# EAGLE schematic untitled (EAGLE 9.5.2)
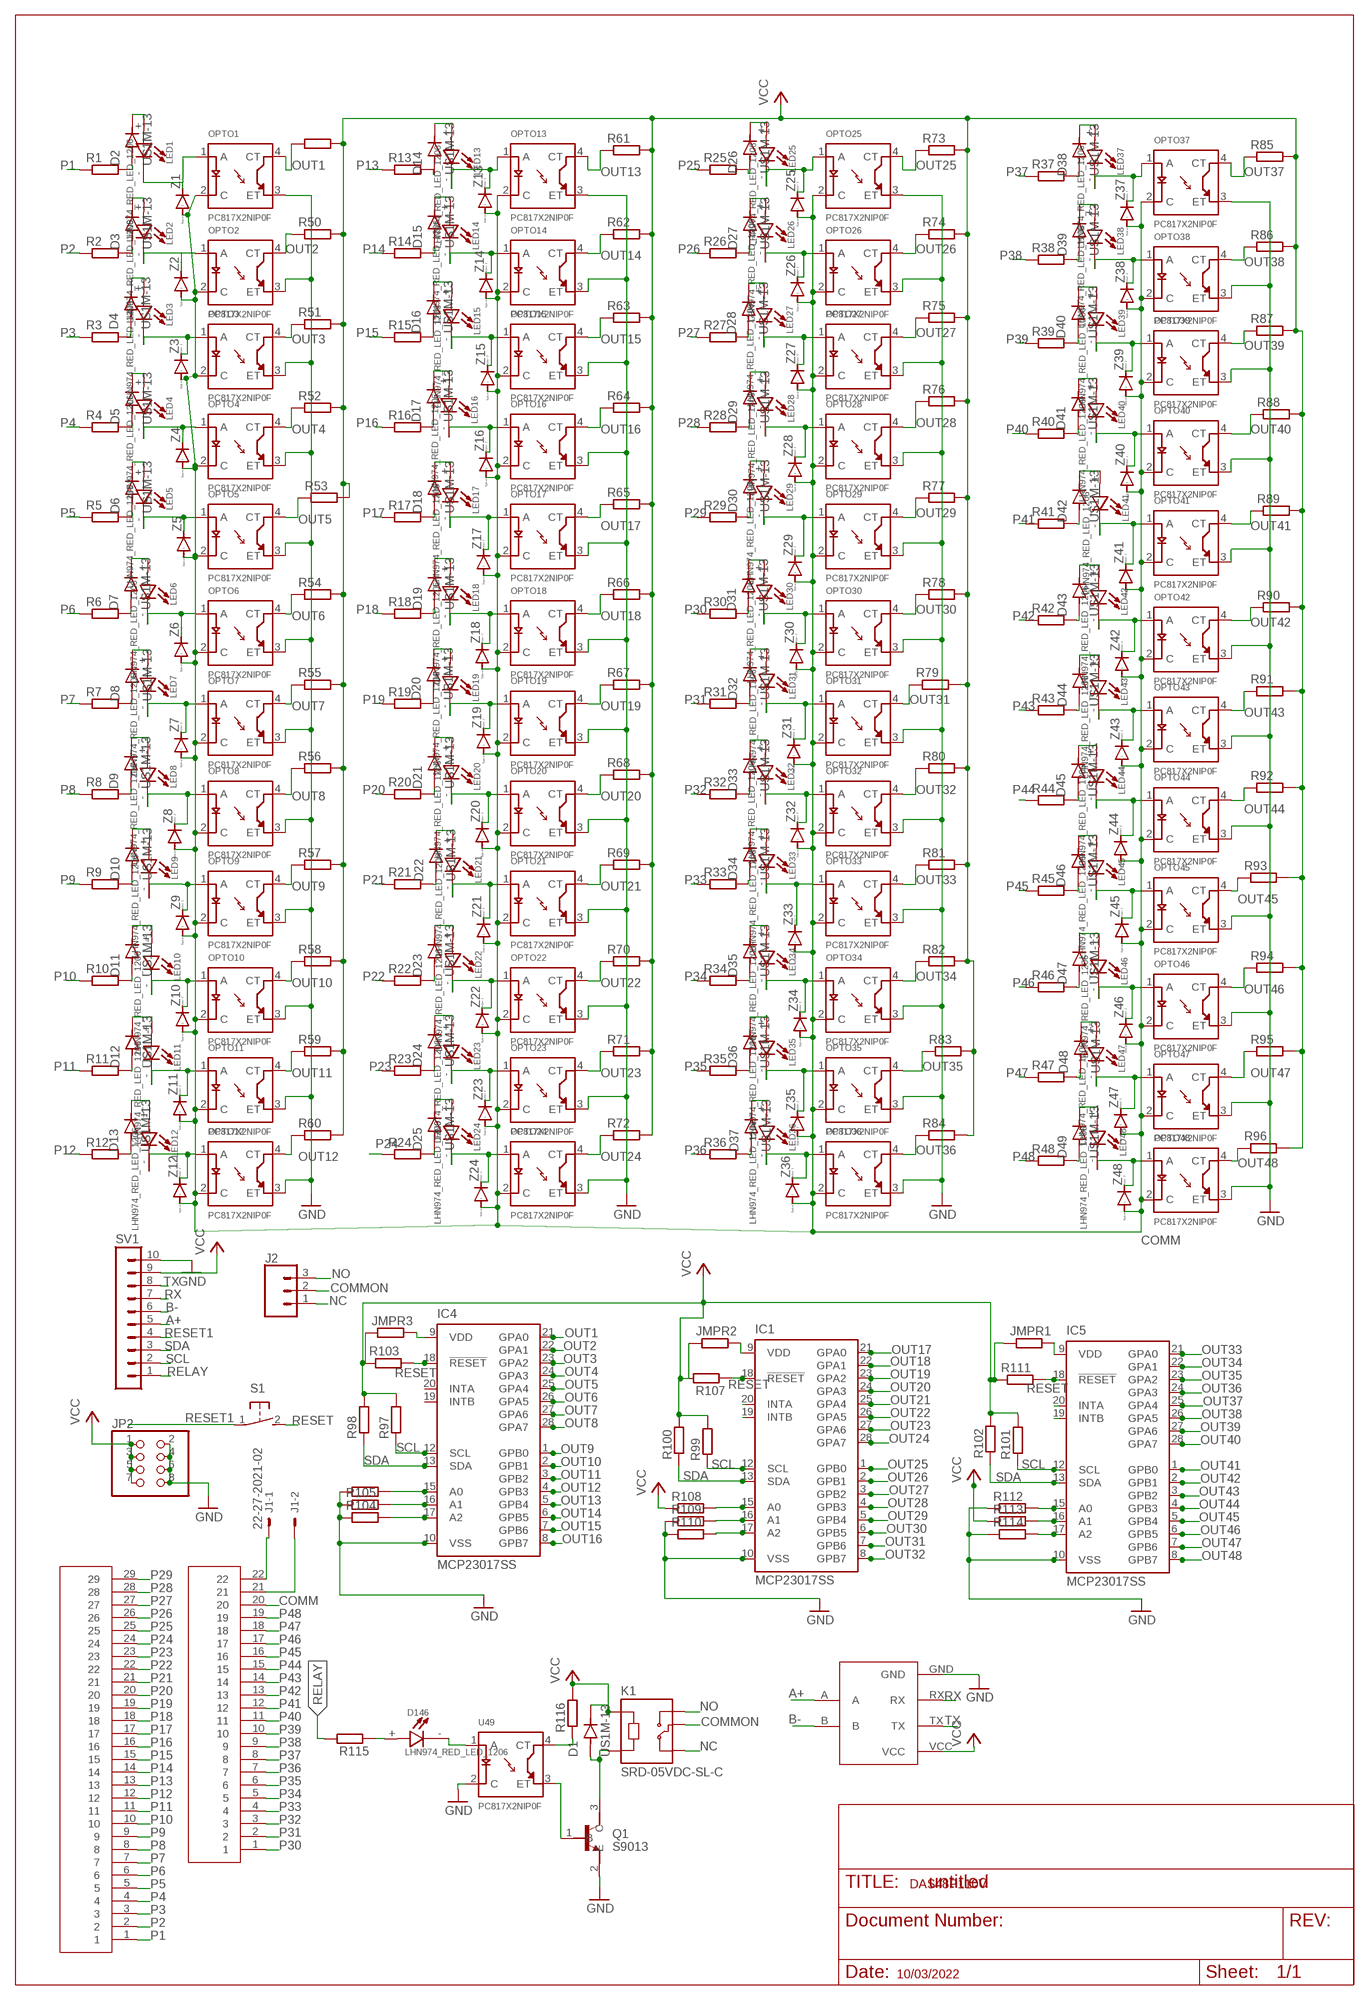
[diagram p0: schematic, sheet 1]

## Parts
D1  US1M-13  [DIOM5226X240N]
D2  US1M-13  [DIOM5226X240N]
D3  US1M-13  [DIOM5226X240N]
D4  US1M-13  [DIOM5226X240N]
D5  US1M-13  [DIOM5226X240N]
D6  US1M-13  [DIOM5226X240N]
D7  US1M-13  [DIOM5226X240N]
D8  US1M-13  [DIOM5226X240N]
D9  US1M-13  [DIOM5226X240N]
D10  US1M-13  [DIOM5226X240N]
D11  US1M-13  [DIOM5226X240N]
D12  US1M-13  [DIOM5226X240N]
D13  US1M-13  [DIOM5226X240N]
D14  US1M-13  [DIOM5226X240N]
D15  US1M-13  [DIOM5226X240N]
D16  US1M-13  [DIOM5226X240N]
D17  US1M-13  [DIOM5226X240N]
D18  US1M-13  [DIOM5226X240N]
D19  US1M-13  [DIOM5226X240N]
D20  US1M-13  [DIOM5226X240N]
D21  US1M-13  [DIOM5226X240N]
D22  US1M-13  [DIOM5226X240N]
D23  US1M-13  [DIOM5226X240N]
D24  US1M-13  [DIOM5226X240N]
D25  US1M-13  [DIOM5226X240N]
D26  US1M-13  [DIOM5226X240N]
D27  US1M-13  [DIOM5226X240N]
D28  US1M-13  [DIOM5226X240N]
D29  US1M-13  [DIOM5226X240N]
D30  US1M-13  [DIOM5226X240N]
D31  US1M-13  [DIOM5226X240N]
D32  US1M-13  [DIOM5226X240N]
D33  US1M-13  [DIOM5226X240N]
D34  US1M-13  [DIOM5226X240N]
D35  US1M-13  [DIOM5226X240N]
D36  US1M-13  [DIOM5226X240N]
D37  US1M-13  [DIOM5226X240N]
D38  US1M-13  [DIOM5226X240N]
D39  US1M-13  [DIOM5226X240N]
D40  US1M-13  [DIOM5226X240N]
D41  US1M-13  [DIOM5226X240N]
D42  US1M-13  [DIOM5226X240N]
D43  US1M-13  [DIOM5226X240N]
D44  US1M-13  [DIOM5226X240N]
D45  US1M-13  [DIOM5226X240N]
D46  US1M-13  [DIOM5226X240N]
D47  US1M-13  [DIOM5226X240N]
D48  US1M-13  [DIOM5226X240N]
D49  US1M-13  [DIOM5226X240N]
D146  LHN974_RED_LED_1206  [LEDC3216X120N]
HEADER-22P1  HEADER-22P  [HEADER-29P]
HEADER-29P1  HEADER-29P  [HEADER-29P]
IC1  MCP23017SS  [SSOP28DB]
IC4  MCP23017SS  [SSOP28DB]
IC5  MCP23017SS  [SSOP28DB]
J1  22-27-2021-02  [6410-02]
J2  CONN_03LONGPADS  [1X03_LONGPADS]
JMPR1  R-EU_R0402  [R0402]
JMPR2  R-EU_R0402  [R0402]
JMPR3  R-EU_R0402  [R0402]
JP2  PINHD-2X4  [2X04]
K1  SRD-05VDC-SL-C  [RELAY_SRD-05VDC-SL-C]
LED1  LHN974_RED_LED_1206  [LEDC3216X120N]
LED2  LHN974_RED_LED_1206  [LEDC3216X120N]
LED3  LHN974_RED_LED_1206  [LEDC3216X120N]
LED4  LHN974_RED_LED_1206  [LEDC3216X120N]
LED5  LHN974_RED_LED_1206  [LEDC3216X120N]
LED6  LHN974_RED_LED_1206  [LEDC3216X120N]
LED7  LHN974_RED_LED_1206  [LEDC3216X120N]
LED8  LHN974_RED_LED_1206  [LEDC3216X120N]
LED9  LHN974_RED_LED_1206  [LEDC3216X120N]
LED10  LHN974_RED_LED_1206  [LEDC3216X120N]
LED11  LHN974_RED_LED_1206  [LEDC3216X120N]
LED12  LHN974_RED_LED_1206  [LEDC3216X120N]
LED13  LHN974_RED_LED_1206  [LEDC3216X120N]
LED14  LHN974_RED_LED_1206  [LEDC3216X120N]
LED15  LHN974_RED_LED_1206  [LEDC3216X120N]
LED16  LHN974_RED_LED_1206  [LEDC3216X120N]
LED17  LHN974_RED_LED_1206  [LEDC3216X120N]
LED18  LHN974_RED_LED_1206  [LEDC3216X120N]
LED19  LHN974_RED_LED_1206  [LEDC3216X120N]
LED20  LHN974_RED_LED_1206  [LEDC3216X120N]
LED21  LHN974_RED_LED_1206  [LEDC3216X120N]
LED22  LHN974_RED_LED_1206  [LEDC3216X120N]
LED23  LHN974_RED_LED_1206  [LEDC3216X120N]
LED24  LHN974_RED_LED_1206  [LEDC3216X120N]
LED25  LHN974_RED_LED_1206  [LEDC3216X120N]
LED26  LHN974_RED_LED_1206  [LEDC3216X120N]
LED27  LHN974_RED_LED_1206  [LEDC3216X120N]
LED28  LHN974_RED_LED_1206  [LEDC3216X120N]
LED29  LHN974_RED_LED_1206  [LEDC3216X120N]
LED30  LHN974_RED_LED_1206  [LEDC3216X120N]
LED31  LHN974_RED_LED_1206  [LEDC3216X120N]
LED32  LHN974_RED_LED_1206  [LEDC3216X120N]
LED33  LHN974_RED_LED_1206  [LEDC3216X120N]
LED34  LHN974_RED_LED_1206  [LEDC3216X120N]
LED35  LHN974_RED_LED_1206  [LEDC3216X120N]
LED36  LHN974_RED_LED_1206  [LEDC3216X120N]
LED37  LHN974_RED_LED_1206  [LEDC3216X120N]
LED38  LHN974_RED_LED_1206  [LEDC3216X120N]
LED39  LHN974_RED_LED_1206  [LEDC3216X120N]
LED40  LHN974_RED_LED_1206  [LEDC3216X120N]
LED41  LHN974_RED_LED_1206  [LEDC3216X120N]
LED42  LHN974_RED_LED_1206  [LEDC3216X120N]
LED43  LHN974_RED_LED_1206  [LEDC3216X120N]
LED44  LHN974_RED_LED_1206  [LEDC3216X120N]
LED45  LHN974_RED_LED_1206  [LEDC3216X120N]
LED46  LHN974_RED_LED_1206  [LEDC3216X120N]
LED47  LHN974_RED_LED_1206  [LEDC3216X120N]
LED48  LHN974_RED_LED_1206  [LEDC3216X120N]
OPTO1  PC817X2NIP0F  [SOT254P975X400-4N]
OPTO2  PC817X2NIP0F  [SOT254P975X400-4N]
OPTO3  PC817X2NIP0F  [SOT254P975X400-4N]
OPTO4  PC817X2NIP0F  [SOT254P975X400-4N]
OPTO5  PC817X2NIP0F  [SOT254P975X400-4N]
OPTO6  PC817X2NIP0F  [SOT254P975X400-4N]
OPTO7  PC817X2NIP0F  [SOT254P975X400-4N]
OPTO8  PC817X2NIP0F  [SOT254P975X400-4N]
OPTO9  PC817X2NIP0F  [SOT254P975X400-4N]
OPTO10  PC817X2NIP0F  [SOT254P975X400-4N]
OPTO11  PC817X2NIP0F  [SOT254P975X400-4N]
OPTO12  PC817X2NIP0F  [SOT254P975X400-4N]
OPTO13  PC817X2NIP0F  [SOT254P975X400-4N]
OPTO14  PC817X2NIP0F  [SOT254P975X400-4N]
OPTO15  PC817X2NIP0F  [SOT254P975X400-4N]
OPTO16  PC817X2NIP0F  [SOT254P975X400-4N]
OPTO17  PC817X2NIP0F  [SOT254P975X400-4N]
OPTO18  PC817X2NIP0F  [SOT254P975X400-4N]
OPTO19  PC817X2NIP0F  [SOT254P975X400-4N]
OPTO20  PC817X2NIP0F  [SOT254P975X400-4N]
OPTO21  PC817X2NIP0F  [SOT254P975X400-4N]
OPTO22  PC817X2NIP0F  [SOT254P975X400-4N]
OPTO23  PC817X2NIP0F  [SOT254P975X400-4N]
OPTO24  PC817X2NIP0F  [SOT254P975X400-4N]
OPTO25  PC817X2NIP0F  [SOT254P975X400-4N]
OPTO26  PC817X2NIP0F  [SOT254P975X400-4N]
OPTO27  PC817X2NIP0F  [SOT254P975X400-4N]
OPTO28  PC817X2NIP0F  [SOT254P975X400-4N]
OPTO29  PC817X2NIP0F  [SOT254P975X400-4N]
OPTO30  PC817X2NIP0F  [SOT254P975X400-4N]
OPTO31  PC817X2NIP0F  [SOT254P975X400-4N]
OPTO32  PC817X2NIP0F  [SOT254P975X400-4N]
OPTO33  PC817X2NIP0F  [SOT254P975X400-4N]
OPTO34  PC817X2NIP0F  [SOT254P975X400-4N]
OPTO35  PC817X2NIP0F  [SOT254P975X400-4N]
OPTO36  PC817X2NIP0F  [SOT254P975X400-4N]
OPTO37  PC817X2NIP0F  [SOT254P975X400-4N]
OPTO38  PC817X2NIP0F  [SOT254P975X400-4N]
OPTO39  PC817X2NIP0F  [SOT254P975X400-4N]
OPTO40  PC817X2NIP0F  [SOT254P975X400-4N]
OPTO41  PC817X2NIP0F  [SOT254P975X400-4N]
OPTO42  PC817X2NIP0F  [SOT254P975X400-4N]
OPTO43  PC817X2NIP0F  [SOT254P975X400-4N]
OPTO44  PC817X2NIP0F  [SOT254P975X400-4N]
OPTO45  PC817X2NIP0F  [SOT254P975X400-4N]
OPTO46  PC817X2NIP0F  [SOT254P975X400-4N]
OPTO47  PC817X2NIP0F  [SOT254P975X400-4N]
OPTO48  PC817X2NIP0F  [SOT254P975X400-4N]
Q1  S9013  [SOT95P240X120-3N]
R1  R-EU_0617/17  [0617/17]
R2  R-EU_0617/17  [0617/17]
R3  R-EU_0617/17  [0617/17]
R4  R-EU_0617/17  [0617/17]
R5  R-EU_0617/17  [0617/17]
R6  R-EU_0617/17  [0617/17]
R7  R-EU_0617/17  [0617/17]
R8  R-EU_0617/17  [0617/17]
R9  R-EU_0617/17  [0617/17]
R10  R-EU_0617/17  [0617/17]
R11  R-EU_0617/17  [0617/17]
R12  R-EU_0617/17  [0617/17]
R13  R-EU_0617/17  [0617/17]
R14  R-EU_0617/17  [0617/17]
R15  R-EU_0617/17  [0617/17]
R16  R-EU_0617/17  [0617/17]
R17  R-EU_0617/17  [0617/17]
R18  R-EU_0617/17  [0617/17]
R19  R-EU_0617/17  [0617/17]
R20  R-EU_0617/17  [0617/17]
R21  R-EU_0617/17  [0617/17]
R22  R-EU_0617/17  [0617/17]
R23  R-EU_0617/17  [0617/17]
R24  R-EU_0617/17  [0617/17]
R25  R-EU_0617/17  [0617/17]
R26  R-EU_0617/17  [0617/17]
R27  R-EU_0617/17  [0617/17]
R28  R-EU_0617/17  [0617/17]
R29  R-EU_0617/17  [0617/17]
R30  R-EU_0617/17  [0617/17]
R31  R-EU_0617/17  [0617/17]
R32  R-EU_0617/17  [0617/17]
R33  R-EU_0617/17  [0617/17]
R34  R-EU_0617/17  [0617/17]
R35  R-EU_0617/17  [0617/17]
R36  R-EU_0617/17  [0617/17]
R37  R-EU_0617/17  [0617/17]
R38  R-EU_0617/17  [0617/17]
R39  R-EU_0617/17  [0617/17]
R40  R-EU_0617/17  [0617/17]
R41  R-EU_0617/17  [0617/17]
R42  R-EU_0617/17  [0617/17]
R43  R-EU_0617/17  [0617/17]
R44  R-EU_0617/17  [0617/17]
R45  R-EU_0617/17  [0617/17]
R46  R-EU_0617/17  [0617/17]
R47  R-EU_0617/17  [0617/17]
R48  R-EU_0617/17  [0617/17]
R49  R-EU_R0805  [R0805]
R50  R-EU_R0805  [R0805]
R51  R-EU_R0805  [R0805]
R52  R-EU_R0805  [R0805]
R53  R-EU_R0805  [R0805]
R54  R-EU_R0805  [R0805]
R55  R-EU_R0805  [R0805]
R56  R-EU_R0805  [R0805]
R57  R-EU_R0805  [R0805]
R58  R-EU_R0805  [R0805]
R59  R-EU_R0805  [R0805]
R60  R-EU_R0805  [R0805]
R61  R-EU_R0805  [R0805]
R62  R-EU_R0805  [R0805]
R63  R-EU_R0805  [R0805]
R64  R-EU_R0805  [R0805]
R65  R-EU_R0805  [R0805]
R66  R-EU_R0805  [R0805]
R67  R-EU_R0805  [R0805]
R68  R-EU_R0805  [R0805]
R69  R-EU_R0805  [R0805]
R70  R-EU_R0805  [R0805]
R71  R-EU_R0805  [R0805]
R72  R-EU_R0805  [R0805]
R73  R-EU_R0805  [R0805]
R74  R-EU_R0805  [R0805]
R75  R-EU_R0805  [R0805]
R76  R-EU_R0805  [R0805]
R77  R-EU_R0805  [R0805]
R78  R-EU_R0805  [R0805]
R79  R-EU_R0805  [R0805]
R80  R-EU_R0805  [R0805]
R81  R-EU_R0805  [R0805]
R82  R-EU_R0805  [R0805]
R83  R-EU_R0805  [R0805]
R84  R-EU_R0805  [R0805]
R85  R-EU_R0805  [R0805]
R86  R-EU_R0805  [R0805]
R87  R-EU_R0805  [R0805]
R88  R-EU_R0805  [R0805]
R89  R-EU_R0805  [R0805]
R90  R-EU_R0805  [R0805]
R91  R-EU_R0805  [R0805]
R92  R-EU_R0805  [R0805]
R93  R-EU_R0805  [R0805]
R94  R-EU_R0805  [R0805]
R95  R-EU_R0805  [R0805]
R96  R-EU_R0805  [R0805]
R97  R-EU_R0805  [R0805]
R98  R-EU_R0805  [R0805]
R99  R-EU_R0805  [R0805]
R100  R-EU_R0805  [R0805]
R101  R-EU_R0805  [R0805]
R102  R-EU_R0805  [R0805]
R103  R-EU_R0805  [R0805]
R104  R-EU_R0805  [R0805]
R105  R-EU_R0805  [R0805]
R106  R-EU_R0805  [R0805]
R107  R-EU_R0805  [R0805]
R108  R-EU_R0805  [R0805]
R109  R-EU_R0805  [R0805]
R110  R-EU_R0805  [R0805]
R111  R-EU_R0805  [R0805]
R112  R-EU_R0805  [R0805]
R113  R-EU_R0805  [R0805]
R114  R-EU_R0805  [R0805]
R115  R-EU_R0805  [R0805]
R116  R-EU_R0805  [R0805]
S1  31-XX  [B3F-31XX]
SV1  MA10-1  [MA10-1]
TTL-RS1  TTL-RS485  [TTL-RS485]
U49  PC817X2NIP0F  [SOT254P975X400-4N]
Z1  DIODE-SOD123  [SOD123]
Z2  DIODE-SOD123  [SOD123]
Z3  DIODE-SOD123  [SOD123]
Z4  DIODE-SOD123  [SOD123]
Z5  DIODE-SOD123  [SOD123]
Z6  DIODE-SOD123  [SOD123]
Z7  DIODE-SOD123  [SOD123]
Z8  DIODE-SOD123  [SOD123]
Z9  DIODE-SOD123  [SOD123]
Z10  DIODE-SOD123  [SOD123]
Z11  DIODE-SOD123  [SOD123]
Z12  DIODE-SOD123  [SOD123]
Z13  DIODE-SOD123  [SOD123]
Z14  DIODE-SOD123  [SOD123]
Z15  DIODE-SOD123  [SOD123]
Z16  DIODE-SOD123  [SOD123]
Z17  DIODE-SOD123  [SOD123]
Z18  DIODE-SOD123  [SOD123]
Z19  DIODE-SOD123  [SOD123]
Z20  DIODE-SOD123  [SOD123]
Z21  DIODE-SOD123  [SOD123]
Z22  DIODE-SOD123  [SOD123]
Z23  DIODE-SOD123  [SOD123]
Z24  DIODE-SOD123  [SOD123]
Z25  DIODE-SOD123  [SOD123]
Z26  DIODE-SOD123  [SOD123]
Z27  DIODE-SOD123  [SOD123]
Z28  DIODE-SOD123  [SOD123]
Z29  DIODE-SOD123  [SOD123]
Z30  DIODE-SOD123  [SOD123]
Z31  DIODE-SOD123  [SOD123]
Z32  DIODE-SOD123  [SOD123]
Z33  DIODE-SOD123  [SOD123]
Z34  DIODE-SOD123  [SOD123]
Z35  DIODE-SOD123  [SOD123]
Z36  DIODE-SOD123  [SOD123]
Z37  DIODE-SOD123  [SOD123]
Z38  DIODE-SOD123  [SOD123]
Z39  DIODE-SOD123  [SOD123]
Z40  DIODE-SOD123  [SOD123]
Z41  DIODE-SOD123  [SOD123]
Z42  DIODE-SOD123  [SOD123]
Z43  DIODE-SOD123  [SOD123]
Z44  DIODE-SOD123  [SOD123]
Z45  DIODE-SOD123  [SOD123]
Z46  DIODE-SOD123  [SOD123]
Z47  DIODE-SOD123  [SOD123]
Z48  DIODE-SOD123  [SOD123]

## Nets
A+: SV1.5 TTL-RS1.A
B-: SV1.6 TTL-RS1.B
COMM: HEADER-22P1.20 OPTO1.2(C) OPTO2.2(C) OPTO3.2(C) OPTO4.2(C) OPTO5.2(C) OPTO6.2(C) OPTO7.2(C) OPTO8.2(C) OPTO9.2(C) OPTO10.2(C) OPTO11.2(C) OPTO12.2(C) OPTO13.2(C) OPTO14.2(C) OPTO15.2(C) OPTO16.2(C) OPTO17.2(C) OPTO18.2(C) OPTO19.2(C) OPTO20.2(C) OPTO21.2(C) OPTO22.2(C) OPTO23.2(C) OPTO24.2(C) OPTO25.2(C) OPTO26.2(C) OPTO27.2(C) OPTO28.2(C) OPTO29.2(C) OPTO30.2(C) OPTO31.2(C) OPTO32.2(C) OPTO33.2(C) OPTO34.2(C) OPTO35.2(C) OPTO36.2(C) OPTO37.2(C) OPTO38.2(C) OPTO39.2(C) OPTO40.2(C) OPTO41.2(C) OPTO42.2(C) OPTO43.2(C) OPTO44.2(C) OPTO45.2(C) OPTO46.2(C) OPTO47.2(C) OPTO48.2(C) Z1.A Z2.A Z3.A Z4.A Z5.A Z6.A Z7.A Z8.A Z9.A Z10.A Z11.A Z12.A Z13.A Z14.A Z15.A Z16.A Z17.A Z18.A Z19.A Z20.A Z21.A Z22.A Z23.A Z24.A Z25.A Z26.A Z27.A Z28.A Z29.A Z30.A Z31.A Z32.A Z33.A Z34.A Z35.A Z36.A Z37.A Z38.A Z39.A Z40.A Z41.A Z42.A Z43.A Z44.A Z45.A Z46.A Z47.A Z48.A
COMMON: J2.2 K1.COM
GND: IC1.10(VSS) IC4.10(VSS) IC5.10(VSS) JP2.2 JP2.4 JP2.6 JP2.8 OPTO1.3(ET) OPTO2.3(ET) OPTO3.3(ET) OPTO4.3(ET) OPTO5.3(ET) OPTO6.3(ET) OPTO7.3(ET) OPTO8.3(ET) OPTO9.3(ET) OPTO10.3(ET) OPTO11.3(ET) OPTO12.3(ET) OPTO13.3(ET) OPTO14.3(ET) OPTO15.3(ET) OPTO16.3(ET) OPTO17.3(ET) OPTO18.3(ET) OPTO19.3(ET) OPTO20.3(ET) OPTO21.3(ET) OPTO22.3(ET) OPTO23.3(ET) OPTO24.3(ET) OPTO25.3(ET) OPTO26.3(ET) OPTO27.3(ET) OPTO28.3(ET) OPTO29.3(ET) OPTO30.3(ET) OPTO31.3(ET) OPTO32.3(ET) OPTO33.3(ET) OPTO34.3(ET) OPTO35.3(ET) OPTO36.3(ET) OPTO37.3(ET) OPTO38.3(ET) OPTO39.3(ET) OPTO40.3(ET) OPTO41.3(ET) OPTO42.3(ET) OPTO43.3(ET) OPTO44.3(ET) OPTO45.3(ET) OPTO46.3(ET) OPTO47.3(ET) OPTO48.3(ET) Q1.2(E) R104.1 R105.1 R106.1 R109.1 R110.1 R112.1 R114.1 SV1.10 TTL-RS1.GND U49.2(C)
N$1: D2.A R1.2
N$2: D2.C(K) LED1.+
N$3: D3.A R2.2
N$4: D3.C(K) LED2.+
N$5: D4.A R3.2
N$6: D4.C(K) LED3.+
N$7: D5.A R4.2
N$8: D5.C(K) LED4.+
N$9: D6.A R5.2
N$10: D6.C(K) LED5.+
N$11: D7.A R6.2
N$12: D7.C(K) LED6.+
N$13: D8.A R7.2
N$14: D8.C(K) LED7.+
N$15: D9.A R8.2
N$16: D9.C(K) LED8.+
N$17: D15.A R14.2
N$18: LED1.- OPTO1.1(A) Z1.C
N$19: LED13.- OPTO13.1(A) Z13.C
N$20: D10.A R9.2
N$21: LED14.- OPTO14.1(A) Z14.C
N$22: D10.C(K) LED9.+
N$23: LED15.- OPTO15.1(A) Z15.C
N$24: D11.A R10.2
N$25: LED16.- OPTO16.1(A) Z16.C
N$26: D11.C(K) LED10.+
N$27: LED17.- OPTO17.1(A) Z17.C
N$28: D12.A R11.2
N$29: LED18.- OPTO18.1(A) Z18.C
N$30: D12.C(K) LED11.+
N$31: LED19.- OPTO19.1(A) Z19.C
N$32: LED20.- OPTO20.1(A) Z20.C
N$33: LED21.- OPTO21.1(A) Z21.C
N$34: D15.C(K) LED14.+
N$35: LED22.- OPTO22.1(A) Z22.C
N$36: D13.A R12.2
N$37: LED23.- OPTO23.1(A) Z23.C
N$38: D13.C(K) LED12.+
N$39: LED24.- OPTO24.1(A) Z24.C
N$40: D14.A R13.2
N$41: LED25.- OPTO25.1(A) Z25.C
N$42: D14.C(K) LED13.+
N$43: LED26.- OPTO26.1(A) Z26.C
N$44: D16.A R15.2
N$45: LED27.- OPTO27.1(A) Z27.C
N$46: D16.C(K) LED15.+
N$47: LED28.- OPTO28.1(A) Z28.C
N$48: D17.A R16.2
N$49: LED29.- OPTO29.1(A) Z29.C
N$50: D17.C(K) LED16.+
N$51: LED30.- OPTO30.1(A) Z30.C
N$52: D18.A R17.2
N$53: LED31.- OPTO31.1(A) Z31.C
N$54: D18.C(K) LED17.+
N$55: LED32.- OPTO32.1(A) Z32.C
N$56: D19.A R18.2
N$57: LED33.- OPTO33.1(A) Z33.C
N$58: D19.C(K) LED18.+
N$59: LED34.- OPTO34.1(A) Z34.C
N$60: D20.A R19.2
N$61: LED35.- OPTO35.1(A) Z35.C
N$62: D20.C(K) LED19.+
N$63: LED36.- OPTO36.1(A) Z36.C
N$64: D32.A R31.2
N$65: LED37.- OPTO37.1(A) Z37.C
N$66: D21.A R20.2
N$67: LED38.- OPTO38.1(A) Z38.C
N$68: D21.C(K) LED20.+
N$69: LED39.- OPTO39.1(A) Z39.C
N$70: LED40.- OPTO40.1(A) Z40.C
N$71: D22.A R21.2
N$72: LED41.- OPTO41.1(A) Z41.C
N$73: D22.C(K) LED21.+
N$74: LED42.- OPTO42.1(A) Z42.C
N$75: LED43.- OPTO43.1(A) Z43.C
N$76: D23.A R22.2
N$77: LED44.- OPTO44.1(A) Z44.C
N$78: D23.C(K) LED22.+
N$79: LED45.- OPTO45.1(A) Z45.C
N$80: D24.A R23.2
N$81: LED46.- OPTO46.1(A) Z46.C
N$82: D24.C(K) LED23.+
N$83: LED47.- OPTO47.1(A) Z47.C
N$84: D25.A R24.2
N$85: LED48.- OPTO48.1(A) Z48.C
N$86: LED2.- OPTO2.1(A) Z2.C
N$87: LED3.- OPTO3.1(A) Z3.C
N$88: LED4.- OPTO4.1(A) Z4.C
N$89: LED5.- OPTO5.1(A) Z5.C
N$90: LED6.- OPTO6.1(A) Z6.C
N$91: LED7.- OPTO7.1(A) Z7.C
N$92: LED8.- OPTO8.1(A) Z8.C
N$93: LED9.- OPTO9.1(A) Z9.C
N$94: LED10.- OPTO10.1(A) Z10.C
N$95: LED11.- OPTO11.1(A) Z11.C
N$96: LED12.- OPTO12.1(A) Z12.C
N$97: D146.- U49.1(A)
N$98: D146.+ R115.1
N$99: R116.1 U49.4(CT)
N$100: IC5.15(A0) R112.2
N$101: D1.A K1.A2 Q1.3(C)
N$102: Q1.1(B) U49.3(ET)
N$103: IC5.16(A1) R113.2
N$104: D25.C(K) LED24.+
N$105: D26.A R25.2
N$106: D26.C(K) LED25.+
N$107: IC1.15(A0) R108.2
N$108: IC1.16(A1) R109.2
N$109: IC4.15(A0) R106.2
N$110: IC4.16(A1) R105.2
N$111: IC4.17(A2) R104.2
N$112: IC5.17(A2) R114.2
N$113: IC1.17(A2) R110.2
N$114: D27.A R26.2
N$115: D27.C(K) LED26.+
N$116: D28.A R27.2
N$117: D28.C(K) LED27.+
N$118: D32.C(K) LED31.+
N$119: D29.A R28.2
N$120: D29.C(K) LED28.+
N$121: D30.C(K) LED29.+
N$122: D30.A R29.2
N$123: D31.A R30.2
N$124: D31.C(K) LED30.+
N$125: D33.C(K) LED32.+
N$126: D33.A R32.2
N$127: D35.A R34.2
N$128: D35.C(K) LED34.+
N$129: D36.A R35.2
N$130: D36.C(K) LED35.+
N$131: D42.A R41.2
N$132: D37.A R36.2
N$133: D37.C(K) LED36.+
N$134: D38.A R37.2
N$135: IC1.20(INTA)
N$136: IC1.19(INTB)
N$137: IC5.20(INTA)
N$138: D34.A R33.2
N$139: D34.C(K) LED33.+
N$140: IC5.19(INTB)
N$141: IC5.9(VDD) JMPR1.2
N$142: D38.C(K) LED37.+
N$143: D39.A R38.2
N$144: D39.C(K) LED38.+
N$145: D40.A R39.2
N$146: D40.C(K) LED39.+
N$147: D41.A R40.2
N$148: D41.C(K) LED40.+
N$149: D42.C(K) LED41.+
N$150: IC1.9(VDD) JMPR2.2
N$151: D43.A R42.2
N$152: D43.C(K) LED42.+
N$153: D44.A R43.2
N$154: D44.C(K) LED43.+
N$155: D45.A R44.2
N$156: D45.C(K) LED44.+
N$157: D46.A R45.2
N$158: D46.C(K) LED45.+
N$159: D47.A R46.2
N$160: D47.C(K) LED46.+
N$161: D48.C(K) LED47.+
N$162: HEADER-22P1.22 J1.1
N$163: HEADER-22P1.21 J1.2
N$164: D48.A R47.2
N$165: D49.A R48.2
N$166: D49.C(K) LED48.+
N$167: IC4.9(VDD) JMPR3.2
NC: J2.1 K1.NC
NO: J2.3 K1.NO
OUT1: IC4.21(GPA0) OPTO1.4(CT) R49.1
OUT2: IC4.22(GPA1) OPTO2.4(CT) R50.1
OUT3: IC4.23(GPA2) OPTO3.4(CT) R51.1
OUT4: IC4.24(GPA3) OPTO4.4(CT) R52.1
OUT5: IC4.25(GPA4) OPTO5.4(CT) R53.1
OUT6: IC4.26(GPA5) OPTO6.4(CT) R54.1
OUT7: IC4.27(GPA6) OPTO7.4(CT) R55.1
OUT8: IC4.28(GPA7) OPTO8.4(CT) R56.1
OUT9: IC4.1(GPB0) OPTO9.4(CT) R57.1
OUT10: IC4.2(GPB1) OPTO10.4(CT) R58.1
OUT11: IC4.3(GPB2) OPTO11.4(CT) R59.1
OUT12: IC4.4(GPB3) OPTO12.4(CT) R60.1
OUT13: IC4.5(GPB4) OPTO13.4(CT) R61.1
OUT14: IC4.6(GPB5) OPTO14.4(CT) R62.1
OUT15: IC4.7(GPB6) OPTO15.4(CT) R63.1
OUT16: IC4.8(GPB7) OPTO16.4(CT) R64.1
OUT17: IC1.21(GPA0) OPTO17.4(CT) R65.1
OUT18: IC1.22(GPA1) OPTO18.4(CT) R66.1
OUT19: IC1.23(GPA2) OPTO19.4(CT) R67.1
OUT20: IC1.24(GPA3) OPTO20.4(CT) R68.1
OUT21: IC1.25(GPA4) OPTO21.4(CT) R69.1
OUT22: IC1.26(GPA5) OPTO22.4(CT) R70.1
OUT23: IC1.27(GPA6) OPTO23.4(CT) R71.1
OUT24: IC1.28(GPA7) OPTO24.4(CT) R72.1
OUT25: IC1.1(GPB0) OPTO25.4(CT) R73.1
OUT26: IC1.2(GPB1) OPTO26.4(CT) R74.1
OUT27: IC1.3(GPB2) OPTO27.4(CT) R75.1
OUT28: IC1.4(GPB3) OPTO28.4(CT) R76.1
OUT29: IC1.5(GPB4) OPTO29.4(CT) R77.1
OUT30: IC1.6(GPB5) OPTO30.4(CT) R78.1
OUT31: IC1.7(GPB6) OPTO31.4(CT) R79.1
OUT32: IC1.8(GPB7) OPTO32.4(CT) R80.1
OUT33: IC5.21(GPA0) OPTO33.4(CT) R81.1
OUT34: IC5.22(GPA1) OPTO34.4(CT) R82.1
OUT35: IC5.23(GPA2) OPTO35.4(CT) R83.1
OUT36: IC5.24(GPA3) OPTO36.4(CT) R84.1
OUT37: IC5.25(GPA4) OPTO37.4(CT) R85.1
OUT38: IC5.26(GPA5) OPTO38.4(CT) R86.1
OUT39: IC5.27(GPA6) OPTO39.4(CT) R87.1
OUT40: IC5.28(GPA7) OPTO40.4(CT) R88.1
OUT41: IC5.1(GPB0) OPTO41.4(CT) R89.1
OUT42: IC5.2(GPB1) OPTO42.4(CT) R90.1
OUT43: IC5.3(GPB2) OPTO43.4(CT) R91.1
OUT44: IC5.4(GPB3) OPTO44.4(CT) R92.1
OUT45: IC5.5(GPB4) OPTO45.4(CT) R93.1
OUT46: IC5.6(GPB5) OPTO46.4(CT) R94.1
OUT47: IC5.7(GPB6) OPTO47.4(CT) R95.1
OUT48: IC5.8(GPB7) OPTO48.4(CT) R96.1
P1: HEADER-29P1.1 R1.1
P2: HEADER-29P1.2 R2.1
P3: HEADER-29P1.3 R3.1
P4: HEADER-29P1.4 R4.1
P5: HEADER-29P1.5 R5.1
P6: HEADER-29P1.6 R6.1
P7: HEADER-29P1.7 R7.1
P8: HEADER-29P1.8 R8.1
P9: HEADER-29P1.9 R9.1
P10: HEADER-29P1.10 R10.1
P11: HEADER-29P1.11 R11.1
P12: HEADER-29P1.12 R12.1
P13: HEADER-29P1.13 R13.1
P14: HEADER-29P1.14 R14.1
P15: HEADER-29P1.15 R15.1
P16: HEADER-29P1.16 R16.1
P17: HEADER-29P1.17 R17.1
P18: HEADER-29P1.18 R18.1
P19: HEADER-29P1.19 R19.1
P20: HEADER-29P1.20 R20.1
P21: HEADER-29P1.21 R21.1
P22: HEADER-29P1.22 R22.1
P23: HEADER-29P1.23 R23.1
P24: HEADER-29P1.24 R24.1
P25: HEADER-29P1.25 R25.1
P26: HEADER-29P1.26 R26.1
P27: HEADER-29P1.27 R27.1
P28: HEADER-29P1.28 R28.1
P29: HEADER-29P1.29 R29.1
P30: HEADER-22P1.1 R30.1
P31: HEADER-22P1.2 R31.1
P32: HEADER-22P1.3 R32.1
P33: HEADER-22P1.4 R33.1
P34: HEADER-22P1.5 R34.1
P35: HEADER-22P1.6 R35.1
P36: HEADER-22P1.7 R36.1
P37: HEADER-22P1.8 R37.1
P38: HEADER-22P1.9 R38.1
P39: HEADER-22P1.10 R39.1
P40: HEADER-22P1.11 R40.1
P41: HEADER-22P1.12 R41.1
P42: HEADER-22P1.13 R42.1
P43: HEADER-22P1.14 R43.1
P44: HEADER-22P1.15 R44.1
P45: HEADER-22P1.16 R45.1
P46: HEADER-22P1.17 R46.1
P47: HEADER-22P1.18 R47.1
P48: HEADER-22P1.19 R48.1
RELAY: R115.2 SV1.1
RESET: IC1.18(!RESET) IC4.18(!RESET) IC5.18(!RESET) R103.2 R107.1 R111.2 S1.2(S)
RESET1: S1.1(P) SV1.4
RX: SV1.7 TTL-RS1.RX
SCL: IC1.12(SCL) IC4.12(SCL) IC5.12(SCL) R97.1 R99.1 R101.1 SV1.2
SDA: IC1.13(SDA) IC4.13(SDA) IC5.13(SDA) R98.1 R100.1 R102.1 SV1.3
TX: SV1.8 TTL-RS1.TX
VCC: D1.C(K) JMPR1.1 JMPR2.1 JMPR3.1 JP2.1 JP2.3 JP2.5 JP2.7 K1.A1 R49.2 R50.2 R51.2 R52.2 R53.2 R54.2 R55.2 R56.2 R57.2 R58.2 R59.2 R60.2 R61.2 R62.2 R63.2 R64.2 R65.2 R66.2 R67.2 R68.2 R69.2 R70.2 R71.2 R72.2 R73.2 R74.2 R75.2 R76.2 R77.2 R78.2 R79.2 R80.2 R81.2 R82.2 R83.2 R84.2 R85.2 R86.2 R87.2 R88.2 R89.2 R90.2 R91.2 R92.2 R93.2 R94.2 R95.2 R96.2 R97.2 R98.2 R99.2 R100.2 R101.2 R102.2 R103.1 R107.2 R108.1 R111.1 R113.1 R116.2 SV1.9 TTL-RS1.VCC
Unconnected: IC4.19(INTB) IC4.20(INTA)

## Notes on the sheet
- DAS48P110V
- 10/03/2022

## Library data of the parts
D1-D49 = US1M-13:US1M-13: Diode, Fast Recovery, 1a, 1kv, Do-214ac-2, Full Reel Check availability <https://pricing.snapeda.com/parts/US1M-13/Diodes%20Incorporated/view-part?ref=eda>; AVAILABILITY: In Stock; DESCRIPTION: Diode Standard 1000 V 1A Surface Mount SMA; MF: Diodes Incorporated; MP: US1M-13; PACKAGE: DO-214AC-214 Diodes Incorporated; PRICE: None; PURCHASE-URL: https://pricing.snapeda.com/search/part/US1M-13/?ref=eda
D146 LED1-LED48 = LHN974_RED_LED_1206:LHN974_RED_LED_1206: LED Chip 1206 Check availability <https://pricing.snapeda.com/parts/LHN974%20RED%20LED%201206/Osram/view-part?ref=eda>; AVAILABILITY: Not in stock; DESCRIPTION: 2.6 V Red LED SMD; MF: Osram; MP: LHN974 RED LED 1206; PACKAGE: None; PRICE: None
HEADER-22P1 = HEADER-22P:HEADER-22P
HEADER-29P1 = HEADER-29P:HEADER-29P
IC1 IC4 IC5 = adafruit_edited:MCP23017: http://ww1.microchip.com/downloads/en/DeviceDoc/21952a.pdf Source: http://ww1.microchip.com/downloads/en/DeviceDoc/21952a.pdf
J1 = con-molex:22-?-02: CONNECTOR wire to board 2.54 mm (.1 inch) pitch header; MF: MOLEX; OC_FARNELL: unknown; OC_NEWARK: unknown
J2 = SparkFun-Connectors:CONN_03: Multi connection point. Often used as Generic Header-pin footprint for 0.1 inch spaced/style header connections On any of the 0.1 inch spaced packages, you can populate with these: Break Away Headers - Straight <https://www.sparkfun.com/products/116> (PRT-00116) Break Away Male Headers - Right Angle <https://www.sparkfun.com/products/553> (PRT-00553) Female Headers <https://www.sparkfun.com/products/115> (PRT-00115) Break Away Headers - Machine Pin <https://www.sparkfun.com/products/117> (PRT-00117) Break Away Female Headers - Swiss Machine Pin <https://www.sparkfun.com/products/743> (PRT-00743) Stackable Header - 3 Pin (Female, 0.1") <https://www.sparkfun.com/products/13875> (PRT-13875) For SCREWTERMINALS and SPRING TERMINALS visit here: Screw Terimnals on SparkFun.com <https://www.sparkfun.com/search/results?term=Screw+Terminals> (5mm/3.5mm/2.54mm spacing) This device is also useful as a general connection point to wire up your design to another part of your project. Our various solder wires solder well into these plated through hole pads. Hook-Up Wire - Assortment (Stranded, 22 AWG) <https://www.sparkfun.com/products/11375> (PRT-11375) Hook-Up Wire - Assortment (Solid Core, 22 AWG) <https://www.sparkfun.com/products/11367> (PRT-11367) View the entire wire category on our website here <https://www.sparkfun.com/categories/141> Special notes: Molex polarized connector foot print use with SKU : PRT-08232 with associated crimp pins and housings.
JMPR1-JMPR3 R1-R116 = rcl:R-EU_: RESISTOR, European symbol; SPICEPREFIX: R
JP2 = pinhead:PINHD-2X4: PIN HEADER
K1 = SRD-05VDC-SL-C:SRD-05VDC-SL-C: 5V Trigger Relay Module For Arduino And Raspberry Pi 5V Trigger Relay Module For Arduino And Raspberry Pi Check availability <https://pricing.snapeda.com/parts/SRD-05VDC-SL-C/Songle%20Relay/view-part?ref=eda>; AVAILABILITY: Not in stock; DESCRIPTION: 5V Trigger Relay Module For Arduino And Raspberry Pi 5V Trigger Relay Module For Arduino And Raspberry Pi; MF: Songle Relay; MP: SRD-05VDC-SL-C; PACKAGE: None; PRICE: None
OPTO1-OPTO48 U49 = PC817X2NIP0F:PC817X2NIP0F: PC817 Series 1 Channel 80 V 5000 Vrms General Purpose Photocoupler - DIP-4 Check availability <https://pricing.snapeda.com/parts/PC817X2NIP0F/Sharp%20Microelectronics/view-part?ref=eda>; AVAILABILITY: Not in stock; DESCRIPTION: Optoisolator Transistor Output 5000Vrms 1 Channel 4-SMD; MF: Sharp Microelectronics; MP: PC817X2NIP0F; PACKAGE: SMD-4 Sharp Microelectronics; PRICE: None
Q1 = S9013:S9013: SMD Transistors NPN 25V-500mA Check availability <https://pricing.snapeda.com/parts/S9013/JCET/view-part?ref=eda>; AVAILABILITY: Not in stock; DESCRIPTION: Bipolar (BJT) Transistor NPN 20V 500mA 625mW Through Hole TO-92-3; MF: JCET; MP: S9013; PACKAGE: SOT-23-3 JCET; PRICE: None
S1 = switch-omron:31-XX: OMRON SWITCH; MPN: B3F-3100; OC_FARNELL: 959704; OC_NEWARK: 36M3582
SV1 = con-lstb:MA10-1: PIN HEADER; OC_FARNELL: unknown; OC_NEWARK: unknown
TTL-RS1 = TTL-RS485:TTL-RS485
Z1-Z48 = diode:DIODE-: DIODE

## Net classes
0 default: drill 0.6 mm, clearance 0.3 mm